# EAGLE design mp28164-buck-boost-flashlight-driver-17mm-mk-2.0.0 (EAGLE 9.2.2)
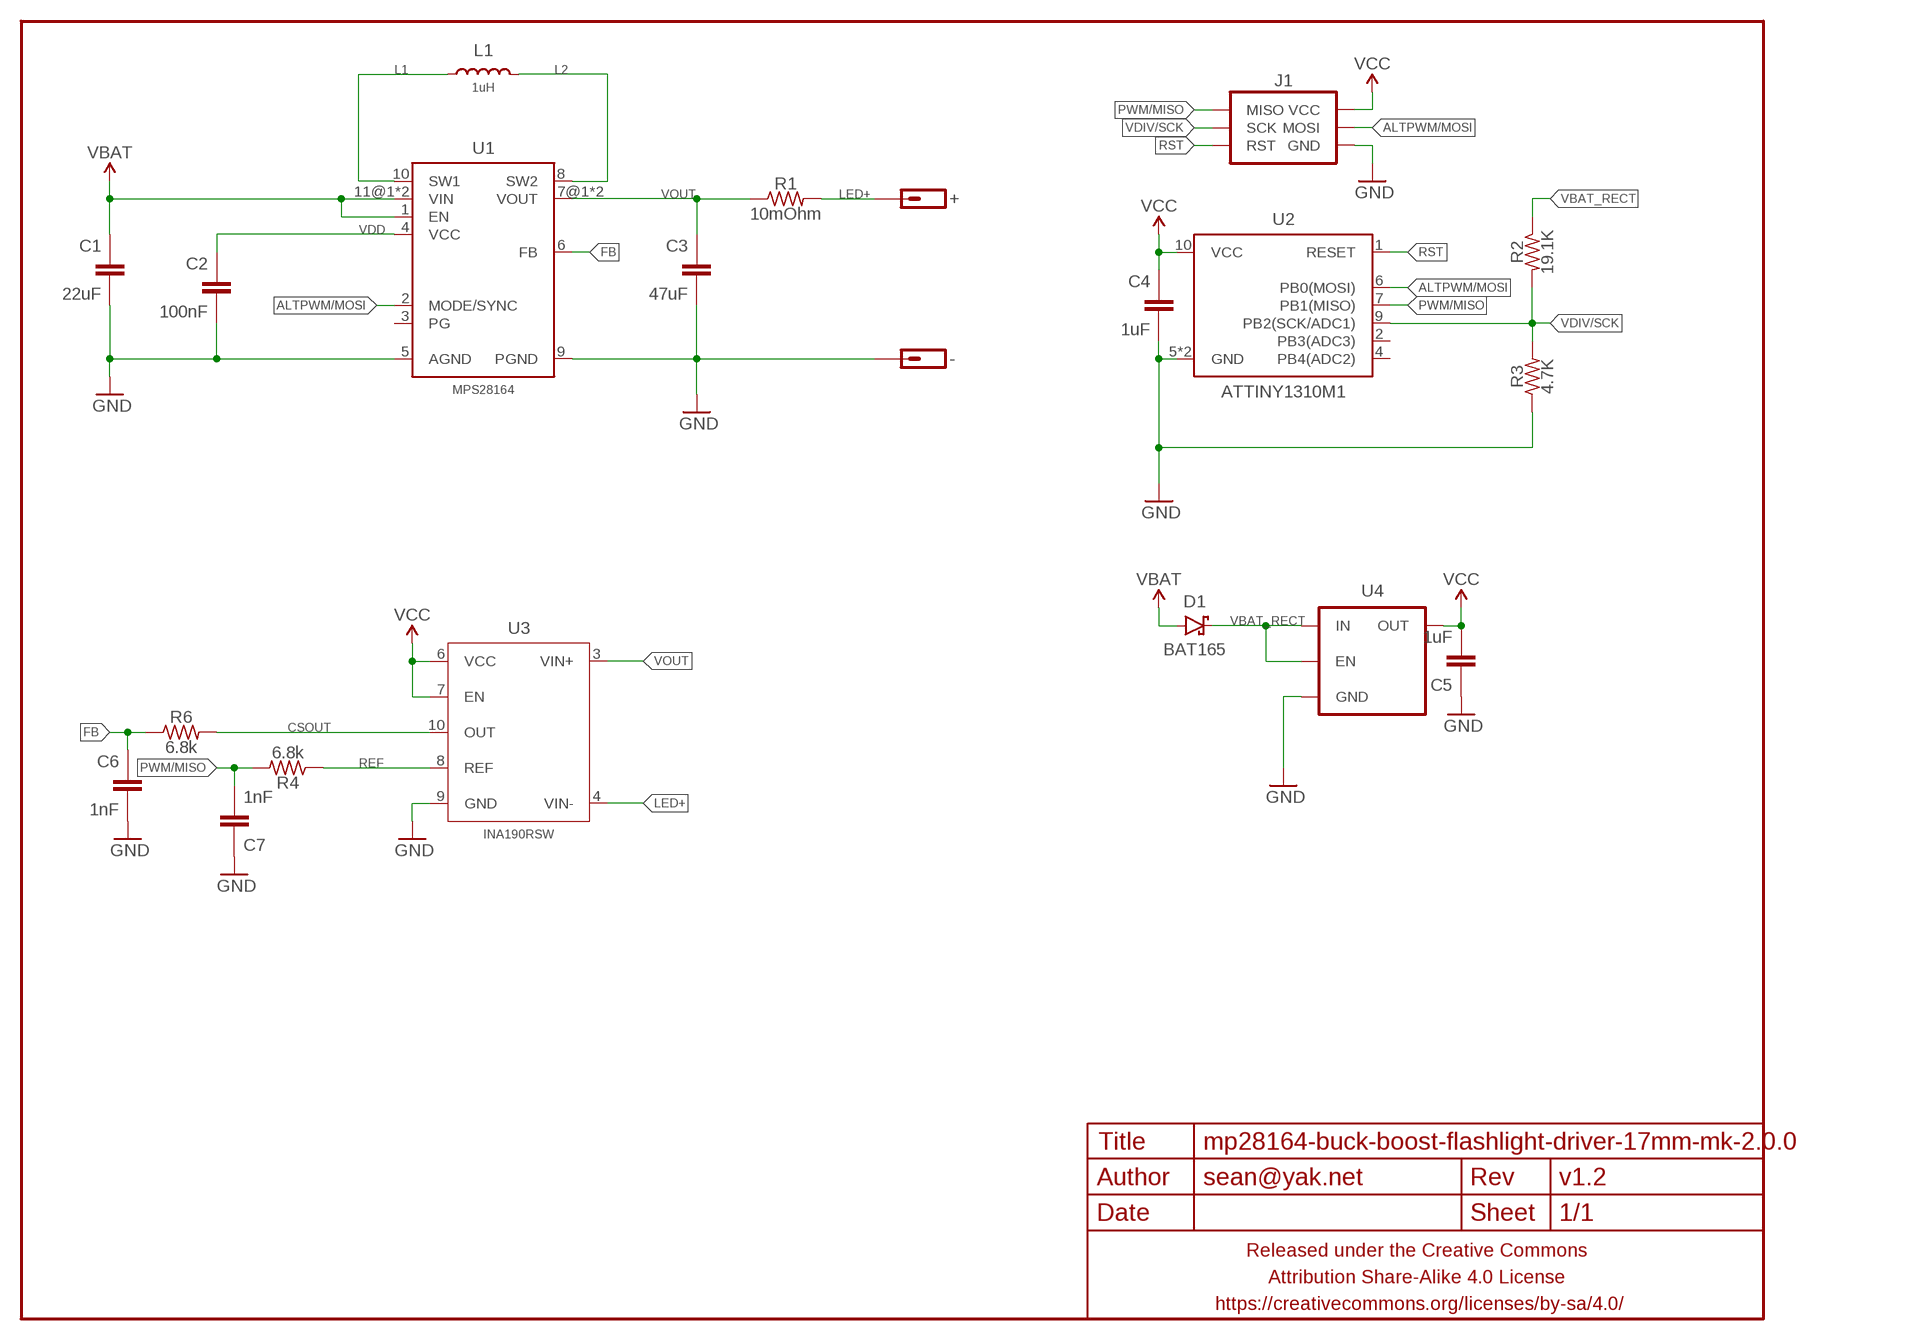
[diagram p0: schematic, sheet 1]

## Parts
+  M01SMD-1.6MMX3.2MM-NS  [1X01-SMD-1.6MMX3.2MM-NS]
-  M01SMD-1.6MMX3.2MM-NS  [1X01-SMD-1.6MMX3.2MM-NS]
C1  22uF  CAPACITOR-CERAMICC1206  [C1206]
C2  100nF  CAPACITOR-CERAMICC0402  [C0402]
C3  47uF  CAPACITOR-CERAMICC1206  [C1206]
C4  1uF  CAPACITOR-CERAMICC0402  [C0402]
C5  1uF  CAPACITOR-CERAMICC0402  [C0402]
C6  1nF  CAPACITOR-CERAMICC0402  [C0402]
C7  1nF  CAPACITOR-CERAMICC0402  [C0402]
D1  BAT165  DIODE-SCHOTTKYSOD323  [SOD323-SCHOTTKY]
FRAME1  FRAME-LETTERNO_PACKAGE  [DUMMY]
J1  AVR_SPI_PRG_6SMD-1.27MM  [2X3-1.27MM-SMD]
L1  1uH  INDUCTORXAL60XX  [XAL60XX]
R1  10mOhm  RESISTORR1206  [R1206]
R2  19.1K  RESISTORR0402  [R0402]
R3  4.7K  RESISTORR0402  [R0402]
R4  6.8k  RESISTORR0402  [R0402]
R6  6.8k  RESISTORR0402  [R0402]
U1  MPS28164  [MPS28164]
U2  ATTINY1310M1  [QFN10(2X5)]
U3  INA190RSW  [UQFN-10]
U4  V_REG_ENTLV700  [SC70]

## Nets
ALTPWM/MOSI: J1.4(MOSI) U1.2(MODE/SYNC) U2.6(PB0(MOSI))
CSOUT: R6.2 U3.10(OUT)
FB: C6.1 R6.1 U1.6(FB)
GND: -.P$1 C1.2 C2.2 C3.2 C4.2 C5.1 C6.2 C7.1 J1.6(GND) R3.1 U1.5(AGND) U1.9(PGND) U2.5(GND) U2.PAD(GND) U3.9(GND) U4.2(GND)
L1: L1.P$1 U1.10(SW1)
L2: L1.P$2 U1.8(SW2)
LED+: +.P$1 R1.2 U3.4(VIN-)
PWM/MISO: C7.2 J1.1(MISO) R4.2 U2.7(PB1(MISO))
REF: R4.1 U3.8(REF)
RST: J1.5(RST) U2.1(RESET)
VBAT: C1.1 D1.A U1.1(EN) U1.11@1(VIN) U1.11@2(VIN)
VBAT_RECT: D1.C R2.1 U4.1(IN) U4.3(EN)
VCC: C4.1 C5.2 J1.2(VCC) U2.10(VCC) U3.6(VCC) U3.7(EN) U4.5(OUT)
VDD: C2.1 U1.4(VCC)
VDIV/SCK: J1.3(SCK) R2.2 R3.2 U2.9(PB2(SCK/ADC1))
VOUT: C3.1 R1.1 U1.7@1(VOUT) U1.7@2(VOUT) U3.3(VIN+)
Unconnected: U1.3(PG) U2.2(PB3(ADC3)) U2.4(PB4(ADC2))

## Library data of the parts
+ - = a_parts:M01: Header 1 Standard 1-pin 0.1" header. Use with straight break away headers (SKU : PRT-00116), right angle break away headers (PRT-00553), swiss pins (PRT-00743), machine pins (PRT-00117), and female headers (PRT-00115).
C1-C7 = a_parts:CAPACITOR-CERAMIC: CAPACITOR, European symbol
D1 = a_parts:DIODE-SCHOTTKY: Schottky diodes in SFE's production catalog BAT20J 1A 23V 0.62Vf RB751 120mA 40V 0.37Vf PMEG4005EJ 0.5A 40V 0.42Vf MBRA140 1A 40V 0.5Vf B340A 3A 40V SMA
FRAME1 = a_parts:FRAME-LETTER: Schematic Frame Standard 8.5x11 US Letter frame; DESIGNER: sean@yak.net; VERSION: v1.2
J1 = a_parts:AVR_SPI_PRG_6: AVR ISP 6 Pin This is the reduced ISP connector for AVR programming. Common on Arduino. This footprint will take up less PCB space and can be used with a 10-pin to 6-pin adapter such as SKU: BOB-08508 **Special note about "TEST_POINT" package. The stop mask is on the top side, so if you want your programming test points to be on the bottom of your board, make sure to place this package on the bottom side of the board. This also ensure that the orientation to program from the bottom side will be correct.
L1 = a_parts:INDUCTOR: Inductors Basic Inductor/Choke - 0603 and 1206. Footprints are not proven and vary greatly between part numbers. SRN6045- 33uH, 20% 1.4A SDR0403-560KL - 56uH, 10%, 500mA RMS/740mA peak
R1-R4 R6 = a_parts:RESISTOR: RESISTOR, American symbol
U1 = a_parts:MPS28164
U2 = a_parts:ATTINY13: Atmel 8-pin 1kB flash uC
U3 = a_parts:INA190
U4 = a_parts:V_REG_EN

## Board
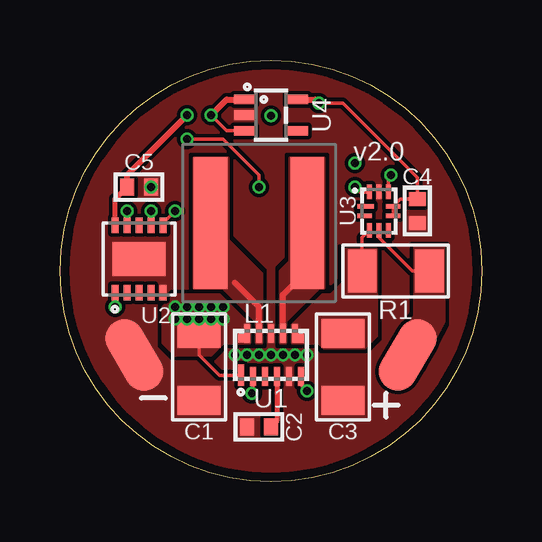
[diagram p1: board, top side]
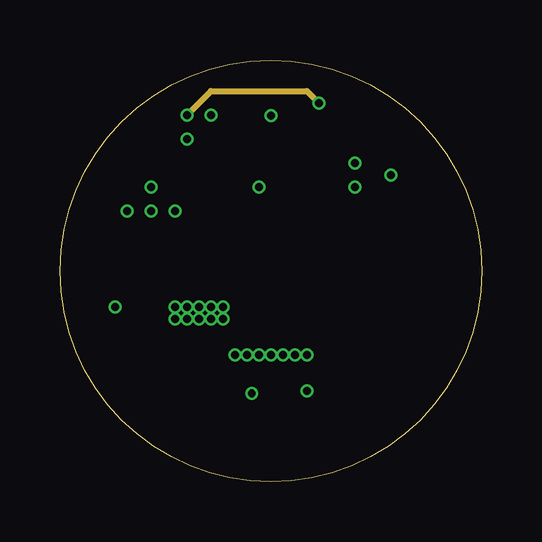
[diagram p2: board, inner layer Route2]
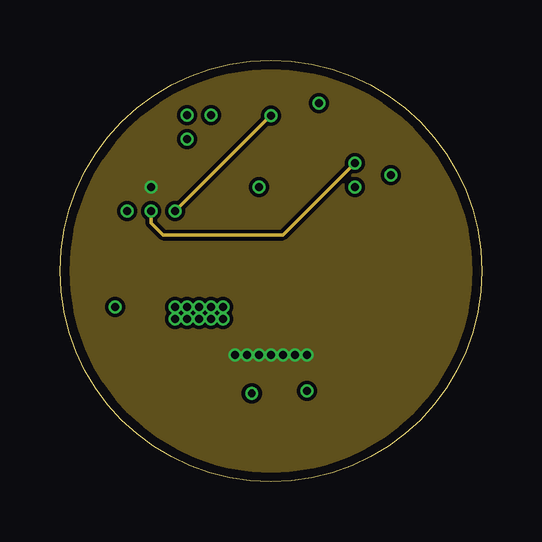
[diagram p3: board, inner layer Route15]
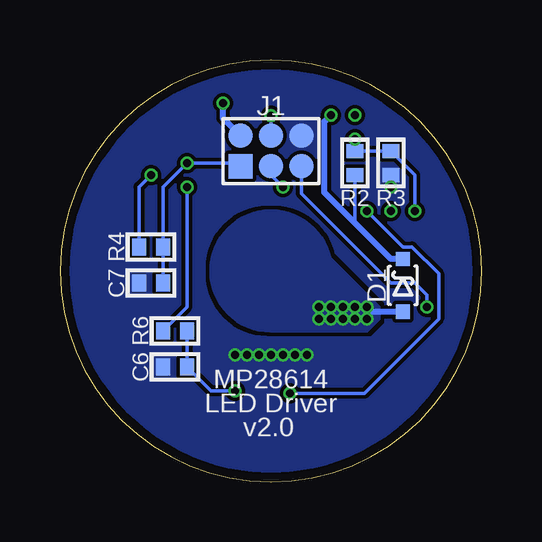
[diagram p4: board, bottom side, seen from below]

Size 17.6 x 17.6 mm. Coordinates in mm from the lower left corner, seen from the top.
Outline: 0,8.8 arc-180 17.6,8.8 arc-180 0,8.8
Copper layers (1*2*15*16): Top 0.035559375mm / dielectric 0.17018125mm / Route2 0.01778125mm / dielectric 47mil / Route15 0.01778125mm / dielectric 0.17018125mm / Bottom 0.035559375mm
Design rules "oshpark-4layer *": minimum track width 5mil, minimum drill 10mil, track to track 5mil, track to pad 5mil, pad to pad 5mil, via to via 5mil, smd to smd 0mil, copper to edge 15mil, drill to drill 6mil, minimum pad ring 4mil, minimum via ring 4mil, stop-mask expansion 2.5mil, vias tented up to drill 0.5mm, thermal gap 10mil

### Footprints (pad centres in the part's own frame; a part is rotated, then mirrored left to right if it is on the bottom)
1X01-SMD-1.6MMX3.2MM-NS = smd 1.6 x 3.2: P$1 0,0
C1206 = smd 1.2 x 1.8: 1 -1.4,0; 2 1.4,0
C0402 = smd 0.6 x 0.7: 1 -0.5,0; 2 0.5,0
SOD323-SCHOTTKY = smd 0.6 x 0.6: A -1.1,0; C 1.1,0
2X3-1.27MM-SMD = smd 1.016 x 1.016: 1 -1.27,-0.635; 2 -1.27,0.635; 3 0,-0.635; 4 0,0.635; 5 1.27,-0.635; 6 1.27,0.635
XAL60XX = smd 1.4 x 5.5: P$1 -2.02,0; P$2 2.02,0
R1206 = smd 1.2 x 1.8: 1 -1.4,0; 2 1.4,0
R0402 = smd 0.6 x 0.7: 1 -0.5,0; 2 0.5,0
MPS28164 = smd 0.9 x 0.25: 1 -0.85,1.25 | smd 0.8 x 0.25: 2 -0.9,0.75; 3 -0.9,0.25; 4 -0.9,-0.25; 5 -0.9,-0.75; 6 -0.9,-1.25; 7@1 0.9,-1; 8 0.9,-0.5; 9 0.9,0; 10 0.9,0.5; 11@1 0.9,1 | smd 0.4 x 0.25: 7@2 0.7,-1.25; 11@2 0.71,1.25
QFN10(2X5) = smd 0.65 x 0.3: 1 -1.4,1; 2 -1.4,0.5; 3 -1.4,0; 4 -1.4,-0.5; 5 -1.4,-1; 6 1.4,-1; 7 1.4,-0.5; 8 1.4,0; 9 1.4,0.5; 10 1.4,1 | smd 1.4 x 2.2: PAD 0,0
UQFN-10 = smd 0.2 x 0.7: 1 -0.2,-0.55 | smd 0.2 x 0.6: 2 0.2,-0.6; 6 0.2,0.6; 7 -0.2,0.6 | smd 0.6 x 0.2: 3 0.8,-0.4; 4 0.8,0; 5 0.8,0.4; 8 -0.8,0.4; 9 -0.8,0; 10 -0.8,-0.4
SC70 = smd 0.4 x 0.9: 1 -0.65,-1.1; 2 0,-1.1; 3 0.65,-1.1; 4 0.65,1.1; 5 -0.65,1.1

### Placement (x,y rotation side)
+  14.5,5.3 150 top
-  3.1,5.3 210 top
C1  5.8,4.8 270 top
C2  8.3,2.3 180 top
C3  11.8,4.8 270 top
C4  14.9,11.3 270 top
C5  3.3,12.3 180 top
C6  12.8,4.8 180 bottom
C7  13.8,8.3 0 bottom
D1  3.3,8.2 90 bottom
FRAME1  -0.2,-0.2 0 top
J1  8.8,13.8 0 bottom
L1  8.3,10.8 0 top
R1  14,8.8 0 top
R2  5.3,13.3 90 bottom
R3  3.8,13.3 90 bottom
R4  13.8,9.8 0 bottom
R6  12.8,6.3 180 bottom
U1  8.8,5.3 90 top
U2  3.3,9.3 90 top
U3  13.3,11.3 270 top
U4  8.8,15.3 270 top

### Tracks (layer width: path | path; a pad name or v marks a point on that pad's centre or on a via)
ALTPWM/MOSI  (via drill 0.33)
  Top 0.152: U1.2 8.05,3.75 v8,3.7 | U2.6 4.3,10.8 v4.8,11.3
  Route15 0.152: v4.8,11.3 8.78,15.28 v8.8,15.28
  Bottom 0.152: v4.8,11.3 3.3,9.8 2.92,9.8 1.8,8.69 1.8,6.8 4.9,3.7 v8,3.7 | J1.4 v8.8,15.28
CSOUT  (via drill 0.33)
  Top 0.152: v12.3,12.3 12.5,12.1 U3.10
  Bottom 0.152: v12.3,12.3 12.3,7.3 R6.2
FB  (via drill 0.33)
  Top 0.152: U1.6 10.05,4.05 v10.3,3.8
  Bottom 0.152: v10.3,3.8 11.3,3.8 C6.1 R6.1
GND  (via drill 0.33)
  other vias: 7.8,5.3 8.3,5.3 8.8,5.3 9.3,5.3 9.8,5.3 7.3,5.3 10.3,5.3 3.8,12.3
  pour Bottom (isolate 0.152, rank 6, no thermals): 8.8,0 arc-90 0,8.8 arc-90 8.8,17.6 arc-90 17.6,8.8 arc-90
  pour Top (isolate 0.152, rank 6, no thermals): 8.8,0 arc-90 0,8.8 arc-90 8.8,17.6 arc-90 17.6,8.8 arc-90
  pour Route15 (isolate 0.152, rank 6, no thermals): 8.8,0 arc-90 0,8.8 arc-90 8.8,17.6 arc-90 17.6,8.8 arc-90
L1
  Top 0.25: U1.10 8.3,7.3 7.3,8.3
  pour Top (rank 4, no thermals): 5.6,13.5 5.6,8.1 6.8,8.1 8.2,6.7 8.2,5.8 8.4,5.8 8.4,8.7 7,10.1 7,13.5
L2
  Top 0.25: U1.8 9.3,7.8 9.8,8.3
  pour Top (rank 4, no thermals): 9.2,5.8 9.4,5.8 9.4,6.7 10.8,8.1 11,8.1 11,13.5 9.6,13.5 9.6,9.2 9.2,8.8
LED+
  Top 0.152: U3.4 13.3,10.2 14.7,8.8 R1.2
  pour Top (rank 3, no thermals): 13.8,5.3 14.8,6.9 14.8,9.8 16,9.8 16,6.7 15,4.8 14.3,4
PWM/MISO  (via drill 0.33)
  Top 0.152: U2.7 v3.8,11.3
  Route15 0.152: v3.8,11.3 3.8,10.8 4.3,10.3 9.3,10.3 v12.3,13.3
  Bottom 0.152: J1.1 10.21,13.3 v12.3,13.3 13.3,12.3 R4.2 C7.2
REF  (via drill 0.33)
  Top 0.152: U3.8 13.7,12.7 v13.8,12.8
  Bottom 0.152: v13.8,12.8 14.3,12.3 R4.1
RST  (via drill 0.33)
  Top 0.152: U2.1 v2.3,7.3
  Bottom 0.152: J1.5 7.53,12.03 3.8,8.3 2.8,8.3 2.3,7.8 v2.3,7.3
VBAT  (via drill 0.33)
  Top 0.152: U1.1 6.65,4.45 5.8,5.3 C1.1
  Bottom 0.25: D1.A 4.6,7.1 v4.8,7.3
  other vias: 5.3,7.3 5.3,6.8 5.8,7.3 5.8,6.8 4.8,6.8 6.3,7.3 6.3,6.8 6.8,6.8 6.8,7.3
  pour Bottom (isolate 0.152, no thermals): 6.3,8.8 arc-180 11.3,8.8 arc-180
  pour Top (rank 5, no thermals): 4.8,7.8 4.3,7.3 4.3,5.8 4.8,5.3 6.3,5.3 6.8,5.8 7.9,5.8 7.9,6.7 6.8,7.8
  pour Bottom (rank 4, no thermals): 4.3,7.3 6.3,9.3 8.8,9.3 8.8,6.3 4.8,6.3 4.3,6.8
VBAT_RECT  (via drill 0.33)
  Top 0.152: U4.3 6.95,14.65 v6.3,15.3
  Top 0.25: U4.1 6.95,15.95 v6.3,15.3
  Bottom 0.152: R2.1 5.3,10.8
  Bottom 0.25: D1.C 3.8,9.3 5.3,10.8 6.57,12.07 6.57,15.03 v6.3,15.3
VCC  (via drill 0.33)
  Top 0.152: U3.6 U3.7 14.2,11.8 C4.1 14.9,12.7 11.8,15.8 v10.8,15.8
  Top 0.2: U2.10 2.3,11.8 C5.2
  Top 0.25: v10.8,15.8 10.65,15.95 U4.5 | C5.2 2.8,12.8 v5.3,15.3
  Route2 0.25: v5.3,15.3 6.3,16.3 10.3,16.3 v10.8,15.8
  Bottom 0.25: J1.2 10.8,15.17 v10.8,15.8
VDD
  Top 0.2: U1.4 9.05,2.55 C2.1
VDIV/SCK  (via drill 0.33)
  Top 0.152: U2.9 v2.8,11.3 | v5.3,14.3 6.8,14.3 8.3,12.8 v8.3,12.3
  Bottom 0.152: v2.8,11.3 2.8,12.8 R3.2 R2.2 v5.3,14.3 | J1.3 8.8,12.8 v8.3,12.3
VOUT
  Top 0.152: U3.3 12.6,10.2 R1.1
  pour Top (rank 5, no thermals): 9.7,5.8 9.7,6.7 10.8,7.8 11.3,7.8 11.8,8.3 11.8,9.7 13.2,9.7 13.2,6.1 12.7,5.6 11,5.6 10.8,5.8

### Text on the board
bPlace: LED Driver | MP28614